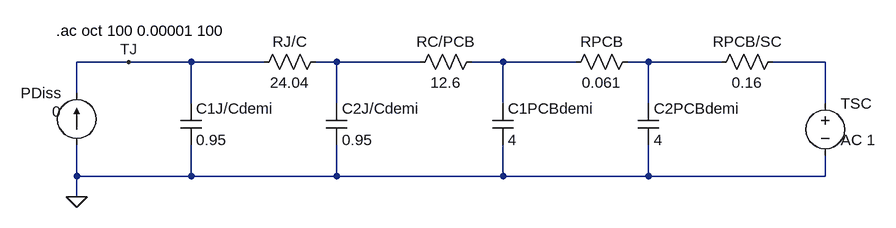
[diagram p0: schematic dissipationChaleur.asc]
dissipationChaleur.asc, the LTspice schematic file:
Version 4
SHEET 1 1048 680
WIRE -320 -64 -400 -64
WIRE -224 -64 -320 -64
WIRE -112 -64 -224 -64
WIRE 0 -64 -32 -64
WIRE 128 -64 0 -64
WIRE 256 -64 208 -64
WIRE 368 -64 256 -64
WIRE 480 -64 448 -64
WIRE 592 -64 480 -64
WIRE 752 -64 672 -64
WIRE -400 -16 -400 -64
WIRE -224 0 -224 -64
WIRE 0 0 0 -64
WIRE 256 0 256 -64
WIRE 480 0 480 -64
WIRE 752 0 752 -64
WIRE -400 112 -400 64
WIRE -224 112 -224 64
WIRE -224 112 -400 112
WIRE 0 112 0 64
WIRE 0 112 -224 112
WIRE 256 112 256 64
WIRE 256 112 0 112
WIRE 480 112 480 64
WIRE 480 112 256 112
WIRE 752 112 752 80
WIRE 752 112 480 112
WIRE -400 144 -400 112
FLAG -400 144 0
FLAG -320 -64 TJ
SYMBOL current -400 64 R180
WINDOW 0 24 80 Left 2
WINDOW 3 24 52 Left 2
WINDOW 123 24 24 Left 2
WINDOW 39 0 0 Left 2
SYMATTR InstName PDiss
SYMATTR Value 0
SYMBOL res -16 -80 R90
WINDOW 0 0 56 VBottom 2
WINDOW 3 32 56 VTop 2
SYMATTR InstName RJ/C
SYMATTR Value 24.04
SYMBOL res 224 -80 R90
WINDOW 0 0 56 VBottom 2
WINDOW 3 32 56 VTop 2
SYMATTR InstName RC/PCB
SYMATTR Value 12.6
SYMBOL res 464 -80 R90
WINDOW 0 0 56 VBottom 2
WINDOW 3 32 56 VTop 2
SYMATTR InstName RPCB
SYMATTR Value 0.061
SYMBOL voltage 752 -16 R0
WINDOW 123 24 72 Left 2
WINDOW 39 0 0 Left 2
WINDOW 3 24 44 Left 2
SYMATTR Value2 AC 1
SYMATTR Value ""
SYMATTR InstName TSC
SYMBOL cap -240 0 R0
SYMATTR InstName C1J/Cdemi
SYMATTR Value 0.95
SYMBOL cap -16 0 R0
SYMATTR InstName C2J/Cdemi
SYMATTR Value 0.95
SYMBOL cap 240 0 R0
SYMATTR InstName C1PCBdemi
SYMATTR Value 4
SYMBOL cap 464 0 R0
SYMATTR InstName C2PCBdemi
SYMATTR Value 4
SYMBOL res 688 -80 R90
WINDOW 0 0 56 VBottom 2
WINDOW 3 32 56 VTop 2
SYMATTR InstName RPCB/SC
SYMATTR Value 0.16
TEXT -432 -112 Left 2 !.ac oct 100 0.00001 100

The netlist it stands for:
* dissipationChaleur.asc
I§PDiss 0 TJ 0
RJ/C N001 TJ 24.04
RC/PCB N002 N001 12.6
RPCB N003 N002 0.061
V§TSC N004 0 AC 1
C1J/Cdemi TJ 0 0.95
C2J/Cdemi N001 0 0.95
C1PCBdemi N002 0 4
C2PCBdemi N003 0 4
RPCB/SC N004 N003 0.16
.ac oct 100 0.00001 100
.backanno
.end

* Results of the author's LTspice run, read from the files saved beside the schematic
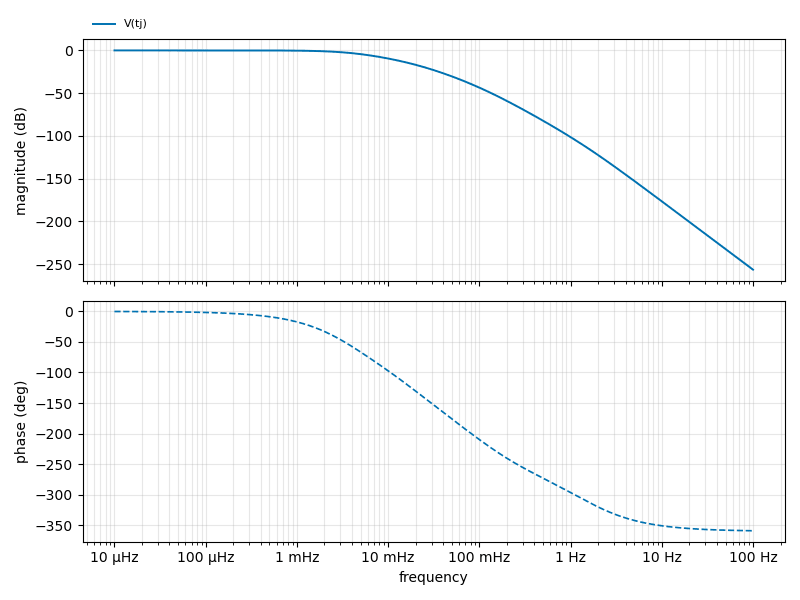
[diagram p1: AC Analysis of dissipationChaleur.asc, plotted from the saved traces]
* AC Analysis, 1 run:
*   V(tj): -0.00 dB at 10 µHz, -256.46 dB at 100 Hz, peak -0.00 dB at 10 µHz, 3 dB below the peak at 3.836 mHz